# EasyEDA Pro project Cat01高低温NI板.eprj, schematic Schematic1
Create Date: 2023-06-02; Page Name: P1; Project Name: Cat01高低温NI板; Schematic Name: Schematic1; Update Date: 2023-07-26; Company: 嘉立创EDA; Page Size: A4; Version: V1.0
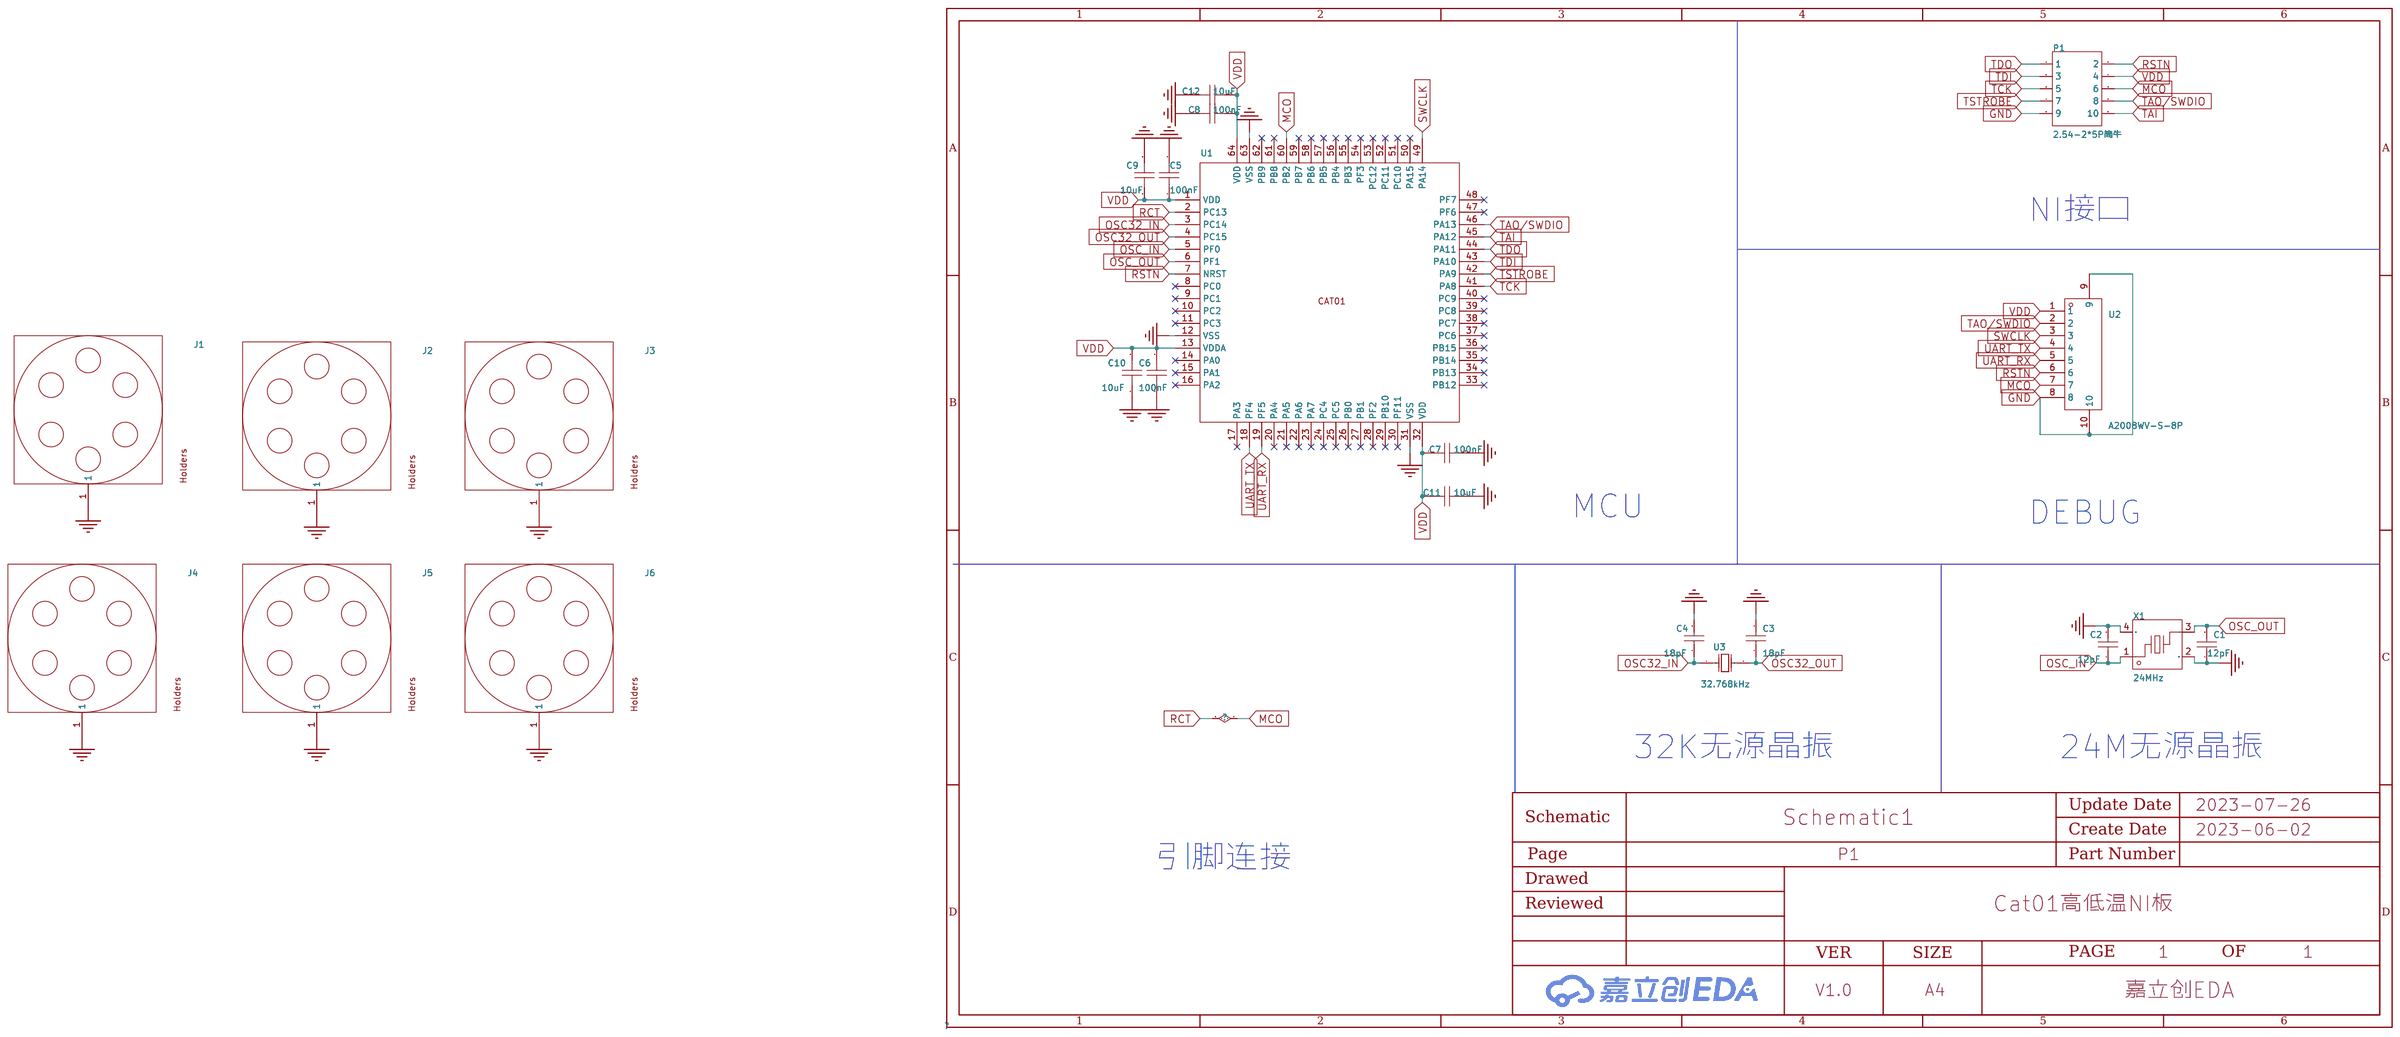
[diagram p0: schematic sheet]

## Parts
C1  12pF  [C0603]
C2  12pF  [C0603]
C3  18pF  [C0603]
C4  18pF  [C0603]
C5  100nF  [C0603]
C6  100nF  [C0603]
C7  100nF  [C0603]
C8  100nF  [C0603]
C9  10uF  [C0603]
C10  10uF  [C0603]
C11  10uF  [C0603]
C12  10uF  [C0603]
J1  -  [DEMO板安装孔]
J2  -  [DEMO板安装孔]
J3  -  [DEMO板安装孔]
J4  -  [DEMO板安装孔]
J5  -  [DEMO板安装孔]
J6  -  [DEMO板安装孔]
P1  2.54-2*5P简牛  [IDC-TH_10P-P2.54_C5665]
U1  -  [LQFP-64_L7.0-W7.0-P0.40-LS9.0-TL]
U2  A2008WV-S-8P  [CONN-SMD_A2008WV-S-8P]
U3  32.768kHz  [CRYSTAL-SMD_L3.2-W1.5-3]
X1  24MHz  [CRYSTAL-SMD_4P-L3.2-W2.5-BL]

## Library data of the parts
C1 C2 = CL10C120JB8NNNC: 容值:12pF;精度:±5%;额定电压:50V;材质(温度系数):C0G;; LCSC Part Name: 12pF ±5% 50V; Supplier Part: C38523; Manufacturer: SAMSUNG(三星); Supplier Footprint: 0603; JLCPCB Part Class: Basic Part; Datasheet: https://atta.szlcsc.com/upload/public/pdf/source/20160103/1457707725436.pdf; Supplier: LCSC; Tolerance: ±5%; Voltage Rated: 50V; Temperature Coefficient: C0G
C3 C4 = CL10C180JB8NNNC: 容值:18pF;精度:±5%;额定电压:50V;材质(温度系数):C0G;; LCSC Part Name: 18pF ±5% 50V; Supplier Part: C1647; Manufacturer: SAMSUNG(三星); Supplier Footprint: 0603; JLCPCB Part Class: Basic Part; Datasheet: https://atta.szlcsc.com/upload/public/pdf/source/20160103/1457707686634.pdf; Supplier: LCSC; Tolerance: ±5%; Voltage Rated: 50V; Temperature Coefficient: C0G
C5-C8 = CC0603KRX7R9BB104: 容值:100nF;精度:±10%;额定电压:50V;材质(温度系数):X7R;; LCSC Part Name: 100nF ±10% 50V; Supplier Part: C14663; Manufacturer: YAGEO(国巨); Supplier Footprint: 0603; JLCPCB Part Class: Basic Part; Datasheet: https://atta.szlcsc.com/upload/public/pdf/source/20180910/C282072_33301C7F631E79921B82A8DAC6BCC5B3.pdf; Supplier: LCSC; Tolerance: ±10%; Voltage Rated: 50V; Temperature Coefficient: X7R
C9-C12 = CL10A106KP8NNNC: 容值:10uF;精度:±10%;额定电压:10V;材质(温度系数):X5R;; LCSC Part Name: 10uF ±10% 10V; Supplier Part: C19702; Manufacturer: SAMSUNG(三星); Supplier Footprint: 0603; JLCPCB Part Class: Basic Part; Datasheet: https://atta.szlcsc.com/upload/public/pdf/source/20160103/1457707703378.pdf; Supplier: LCSC; Tolerance: ±10%; Voltage Rated: 10V; Temperature Coefficient: X5R
J1-J6 = 螺孔_3.1X6MM
P1 = 2.54-2*5P简牛: 连接器类型:简牛座;每排PIN数:5;排数:2;间距:2.54mm;行距:2.54mm;封装形式:直插;触头材质:-;触头镀层:-;; LCSC Part Name: 每排P数:5 排数:2 2.54mm; Supplier Part: C5665; Manufacturer: BOOMELE(博穆精密); Supplier Footprint: 插件,P=2.54mm; JLCPCB Part Class: Extended Part; Datasheet: https://atta.szlcsc.com/upload/public/pdf/source/20140331/1457707037896.pdf; Supplier: LCSC; Connector Type: 简牛座; Pin Number in each Row: 5; Number of Rows: 2; Pitch: 2.54mm; Row Spacing: 2.54mm; Holder Type: 直插
U1 = cat01_LQFP64L
U2 = A2008WV-S-8P: 参考系列:PH;间距:2mm;插针结构:1x8P;排数:1;每排PIN数:8;行距:-;安装方式:-;触头材质:黄铜;; LCSC Part Name: PH 2mm 1x8P 镀锡; Supplier Part: C273128; Manufacturer: CJT(长江连接器); Supplier Footprint: SMD,P=2mm; JLCPCB Part Class: Extended Part; Datasheet: https://atta.szlcsc.com/upload/public/pdf/source/20180913/C273128_BB1852F7672CD820F7AD4E26555E7BEC.pdf; Supplier: LCSC; Reference Series: PH; Pitch: 2mm; Pins Structure: 1x8P; Number of Rows: 1; Number of PINs Per Row: 8; Contact Material: 黄铜
U3 = X1A0000910001: 频率:32.768kHz;频率公差:±20ppm;负载电容:12.5pF;; LCSC Part Name: 32.768kHz ±20ppm 12.5pF; Supplier Part: C841880; Manufacturer: EPSON(爱普生); Supplier Footprint: SMD3215-2P; JLCPCB Part Class: Extended Part; Datasheet: https://atta.szlcsc.com/upload/public/pdf/source/20200925/C841880_D4087E5EAF96E151F1F70ED7FD14B86A.pdf; Supplier: LCSC; Crystal Type: 贴片无源晶振; Frequency Tolerance: ±20ppm; Load Capacitance: 12.5pF; Operating Temperature: -40℃~+125℃
X1 = TSX-3225 24.0000MF20G-AC3: 频率:24MHz;频率公差:±10ppm;负载电容:9pF;; LCSC Part Name: 24MHz ±10ppm 9pF; Supplier Part: C2650460; Manufacturer: EPSON(爱普生); Supplier Footprint: SMD3225-4P; JLCPCB Part Class: Extended Part; Datasheet: https://atta.szlcsc.com/upload/public/pdf/source/20211006/C2650460_BA36087F6A709F8B23ED4CFF7191F6E0.pdf; Supplier: LCSC; Crystal Type: 贴片无源晶振; Frequency Tolerance: ±10ppm; Frequency Stability: ±20ppm; Load Capacitance: 9pF; Equivalent Series Resistance (ESR): 40Ω; Operating Temperature: -40℃~+105℃

## Nets
GND: C1.1 C2.2 C3.2 C4.2 C5.2 C6.1 C7.2 C8.1 C9.2 C10.1 C11.2 C12.1 J1.1 J2.1 J3.1 J4.1 J5.1 J6.1 P1.9 U1.12(VSS) U1.31(VSS) U1.63(VSS) U2.8 U2.9 U2.10 X1.2(GND) X1.4(GND)
VDD: C5.1 C6.2 C7.1 C8.2 C9.1 C10.2 C11.1 C12.2 P1.4 U1.1(VDD) U1.13(VDDA) U1.32(VDD) U1.64(VDD) U2.1
MCO: P1.6 U1.2(PC13) U1.60(PB2) U2.7
OSC32_IN: C4.1 U1.3(PC14) U3.1(OSC1)
OSC32_OUT: C3.1 U1.4(PC15) U3.2(OSC2)
OSC_IN: C2.1 U1.5(PF0) X1.1
OSC_OUT: C1.2 U1.6(PF1) X1.3
RSTN: P1.2 U1.7(NRST) U2.6
SWCLK: U1.49(PA14) U2.3
TAI: P1.10 U1.45(PA12)
TAO/SWDIO: P1.8 U1.46(PA13) U2.2
TCK: P1.5 U1.41(PA8)
TDI: P1.3 U1.43(PA10)
TDO: P1.1 U1.44(PA11)
TSTROBE: P1.7 U1.42(PA9)
UART_RX: U1.19(PF5) U2.5
UART_TX: U1.18(PF4) U2.4

Not connected (* = marked no-connect by the designer): U1 8(PC0)* 9(PC1)* 10(PC2)* 11(PC3)* 14(PA0)* 15(PA1)* 16(PA2)* 17(PA3)* 20(PA4)* 21(PA5)* 22(PA6)* 23(PA7)* 24(PC4)* 25(PC5)* 26(PB0)* 27(PB1)* 28(PF2)* 29(PB10)* 30(PF11)* 33(PB12)* 34(PB13)* 35(PB14)* 36(PB15)* 37(PC6)* 38(PC7)* 39(PC8)* 40(PC9)* 47(PF6)* 48(PF7)* 50(PA15)* 51(PC10)* 52(PC11)* 53(PC12)* 54(PF3)* 55(PB3)* 56(PB4)* 57(PB5)* 58(PB6)* 59(PB7)* 61(PB8)* 62(PB9)*

## Notes on the sheet
- NI接口
- MCU
- DEBUG
- 32K无源晶振
- 24M无源晶振
- 引脚连接
